# EAGLE design midi-select (EAGLE 5.10)
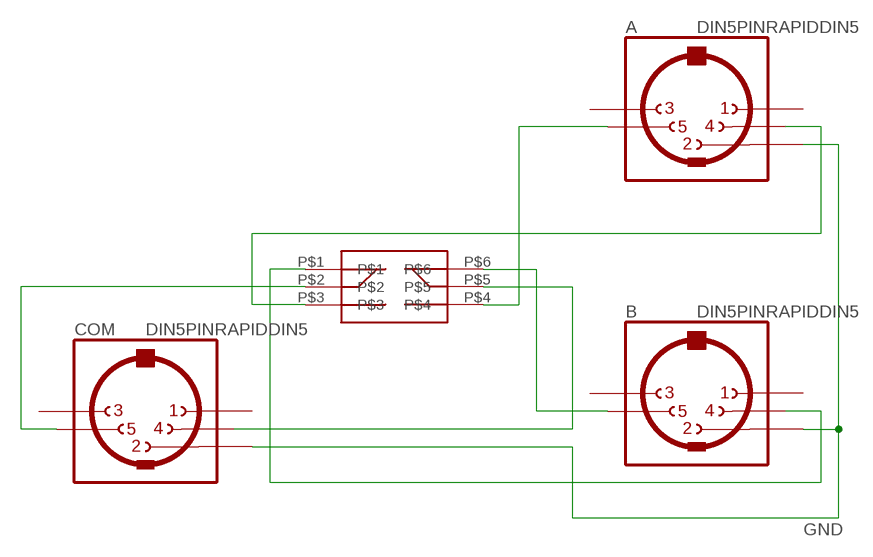
[diagram p0: schematic, sheet 1]

## Parts
A  DIN5PINRAPIDDIN5  [RAPIDDIN5]
B  DIN5PINRAPIDDIN5  [RAPIDDIN5]
COM  DIN5PINRAPIDDIN5  [RAPIDDIN5]
U$1  2P2T_LATCHING  [2P2T_LATCHING]

## Nets
GND: A.2 B.2 COM.2
N$1: COM.5 U$1.P$2
N$2: COM.4 U$1.P$5
N$3: A.4 U$1.P$3
N$4: A.5 U$1.P$4
N$6: B.5 U$1.P$6
N$7: B.4 U$1.P$1
Unconnected: A.1 A.3 B.1 B.3 COM.1 COM.3

## Library data of the parts
A B COM = jasons_stuff:DIN5PIN: Female CONNECTOR 5 pins 90 deg. with shield, horizontal (DIN 41524)
U$1 = jasons_stuff:2P2T_LATCHING

## Board
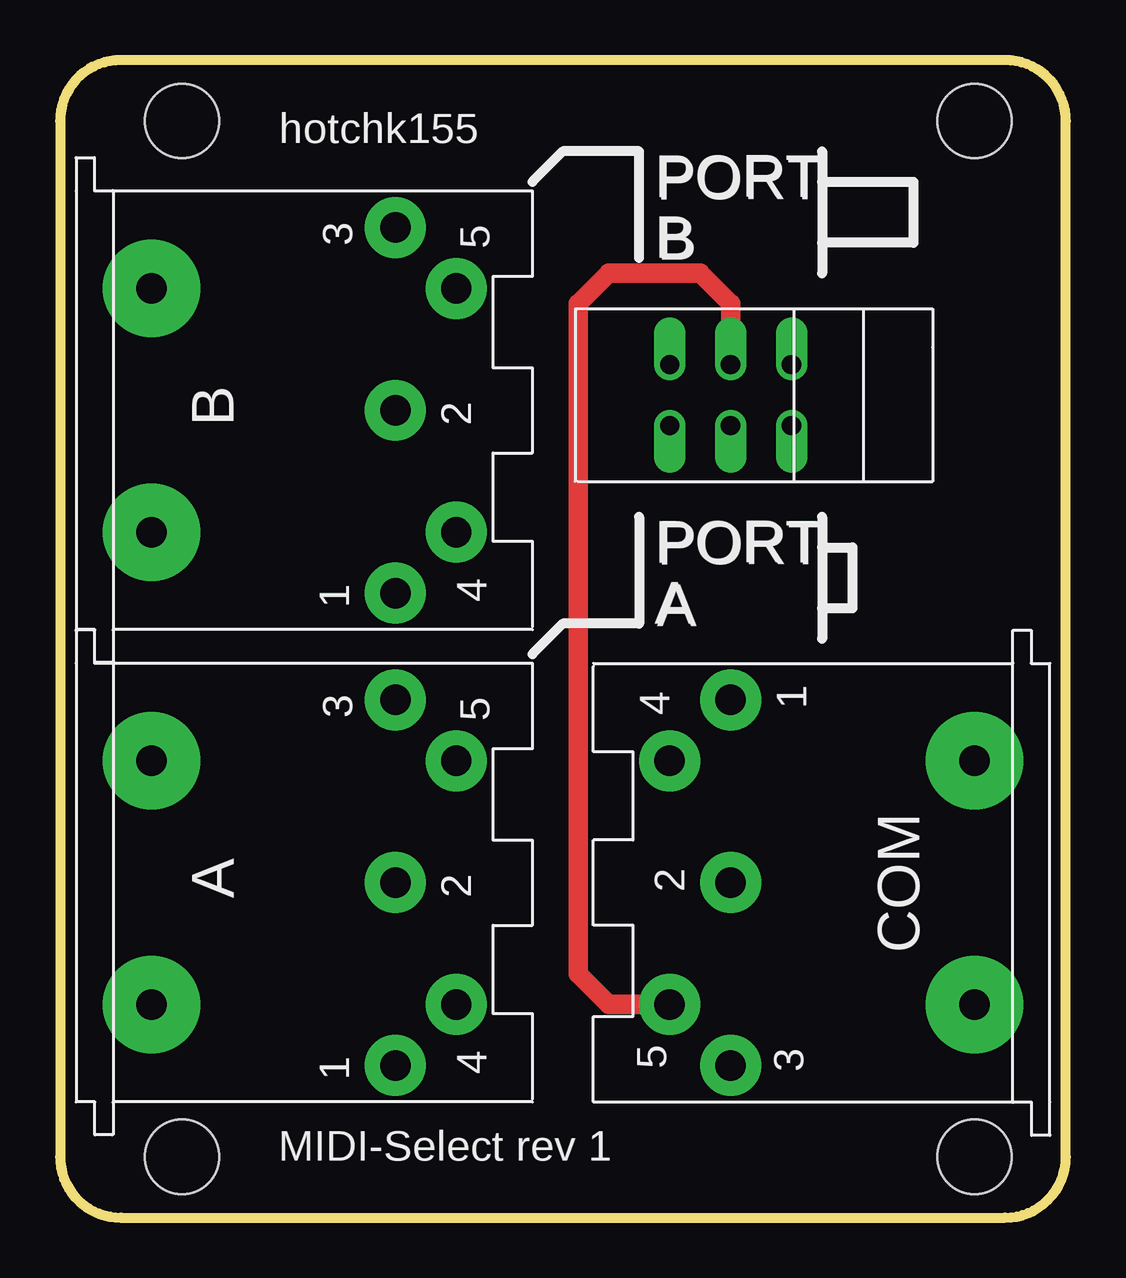
[diagram p1: board, top side]
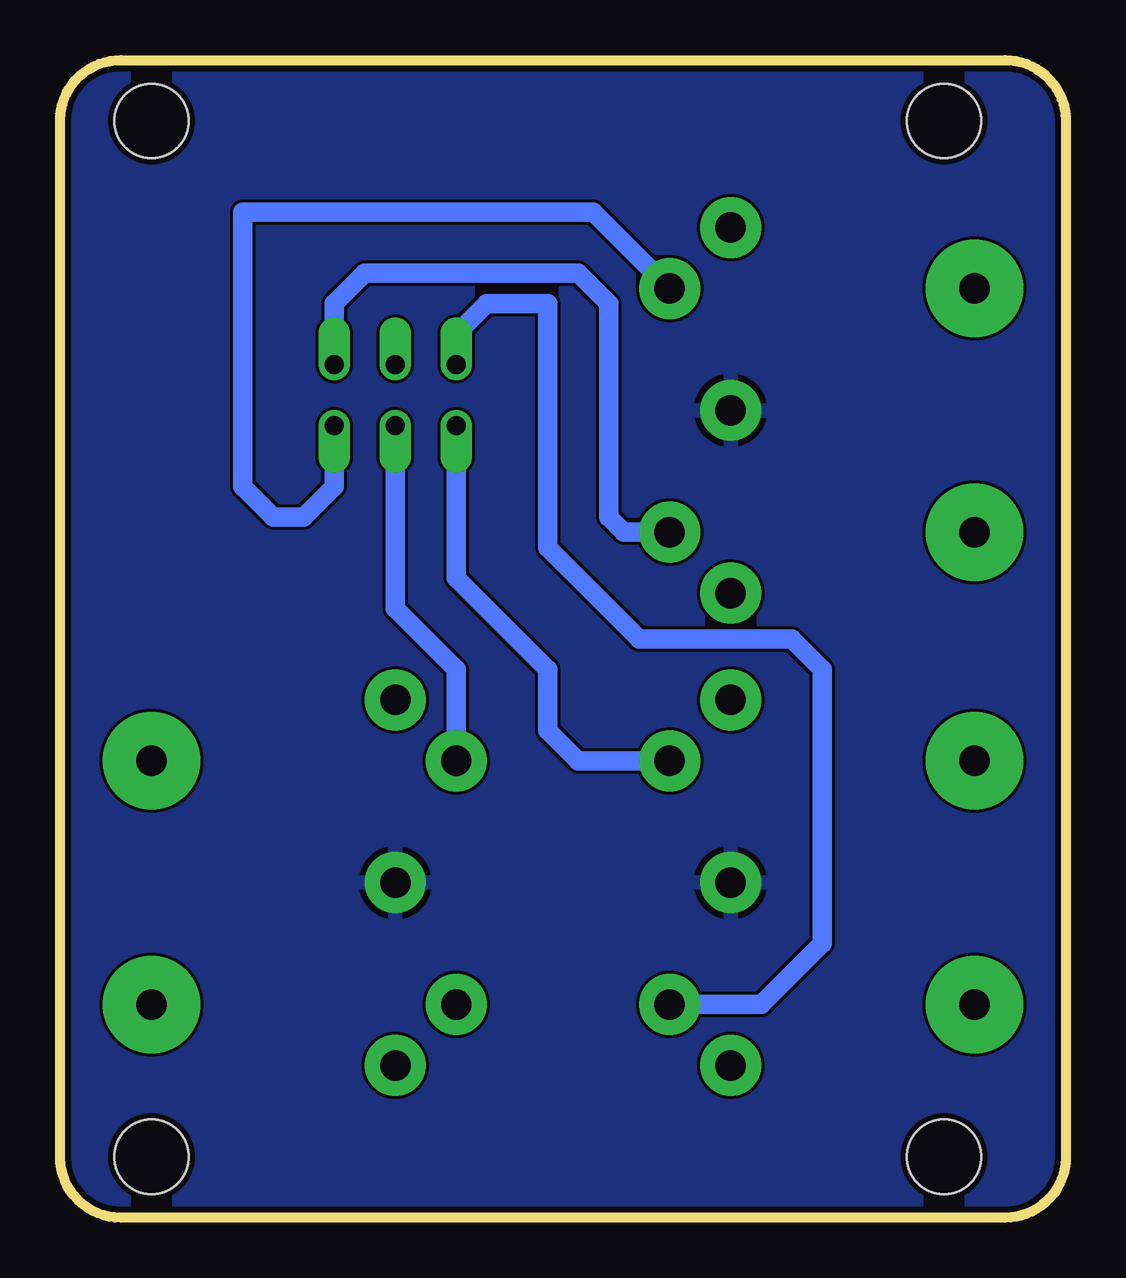
[diagram p2: board, bottom side, seen from below]

Size 41.91 x 48.26 mm. Coordinates in mm from the lower left corner, seen from the top.
Outline: 0,45.72 0,2.54 arc90 2.54,0 39.37,0 arc90 41.91,2.54 41.91,45.72 arc90 39.37,48.26 2.54,48.26 arc90 0,45.72
Copper layers (1*16): Top 0.035mm / dielectric 1.5mm / Bottom 0.035mm
Design rules "dirt_cheap_dirty_boards.v1": minimum track width 5mil, minimum drill 12mil, track to track 5mil, track to pad 5mil, pad to pad 5mil, via to via 5mil, smd to smd 0mil, copper to edge 10mil, drill to drill 10mil, minimum pad ring 10mil, minimum via ring 6mil, stop-mask expansion 2mil, vias tented up to drill 25mil, thermal gap 10mil
Holes 3.1 mm at 5.08,2.54 5.08,45.72 38.1,45.72 38.1,2.54

### Footprints (pad centres in the part's own frame; a part is rotated, then mirrored left to right if it is on the bottom)
RAPIDDIN5 = drill 1.27 pad 2.54 round: 1 7.62,5.08; 2 0,5.08; 3 -7.62,5.08; 4 5.08,7.62; 5 -5.08,7.62 | drill 1.27 pad 4.064 round: NC -5.08,-5.08; NC@ 5.08,-5.08
2P2T_LATCHING = drill 0.8 offset: P$1 -1.27,0; P$2 -1.27,-2.54; P$3 -1.27,-5.08; P$4 1.27,-5.08; P$5 1.27,-2.54; P$6 1.27,0

### Placement (x,y rotation side)
A  8.89,13.97 270 top
B  8.89,33.66 270 top
COM  33.02,13.97 90 top
U$1  30.48,34.29 270 top

### Tracks (layer width: path | path; a pad name or v marks a point on that pad's centre or on a via)
GND
  pour Bottom: -1.27,49.53 -1.27,-1.27 43.18,-1.27 43.18,49.53
N$1
  Top 0.813: COM.5 22.86,8.89 21.59,10.16 21.59,38.1 22.86,39.37 26.67,39.37 27.94,38.1 U$1.P$2
N$2
  Bottom 0.813: COM.4 25.4,22.86 27.94,25.4 U$1.P$5
N$3
  Bottom 0.813: A.4 12.7,8.89 10.16,11.43 10.16,22.86 11.43,24.13 17.78,24.13 21.59,27.94 21.59,38.1 24.13,38.1 25.4,36.83 U$1.P$3
N$4
  Bottom 0.813: A.5 20.32,19.05 21.59,20.32 21.59,22.86 25.4,26.67 U$1.P$4
N$6
  Bottom 0.813: U$1.P$6 30.48,30.48 31.75,29.21 33.02,29.21 34.29,30.48 34.29,41.91 19.69,41.91 B.5
N$7
  Bottom 0.813: B.4 18.41,28.57 19.05,29.21 19.05,38.1 20.32,39.37 29.21,39.37 30.48,38.1 U$1.P$1

### Text on the board
tPlace: hotchk155 | PORT | PORT | B | B | PORT | PORT | A | A | MIDI-Select rev 1